# Altium schematic sheet ADCBoard.SchDoc
size OrCAD A
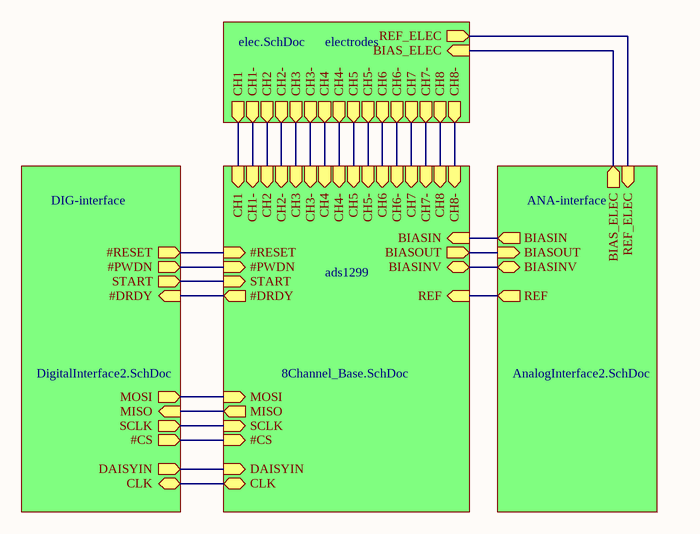
[diagram p0: ADCBoard.SchDoc]

## Sub-sheets
ads1299 = 8Channel_Base.SchDoc: CH1- (in), CH2 (in), CH2- (in), CH3 (in), CH3- (in), CH4 (in), CH4- (in), CH5 (in), CH5- (in), CH6 (in), CH6- (in), CH7 (in), CH7- (in), CH8 (in), CH8- (in), CH1 (in), BIASIN (in), BIASOUT (out), BIASINV (bidir), REF (in), #RESET (in), #PWDN (in), START (in), #DRDY (out), MOSI (in), MISO (out), SCLK (in), #CS (in), DAISYIN (in), CLK (bidir)
ANA-interface = AnalogInterface2.SchDoc: BIAS_ELEC (out), REF_ELEC (in), BIASIN (out), BIASOUT (in), BIASINV (bidir), REF (out)
DIG-interface = DigitalInterface2.SchDoc: #RESET (out), #PWDN (out), START (out), #DRDY (in), MOSI (out), MISO (in), SCLK (out), #CS (out), DAISYIN (out), CLK (bidir)
electrodes = elec.SchDoc: CH1- (out), CH2 (out), CH2- (out), CH3 (out), CH3- (out), CH4 (out), CH4- (out), CH5 (out), CH5- (out), CH6 (out), CH6- (out), CH7 (out), CH7- (out), CH8 (out), CH8- (out), CH1 (out), BIAS_ELEC (in), REF_ELEC (out)

## Nets
(unnamed): sheet ads1299/CH1-, sheet electrodes/CH1-
(unnamed): sheet ads1299/CH2, sheet electrodes/CH2
(unnamed): sheet ads1299/CH2-, sheet electrodes/CH2-
(unnamed): sheet ads1299/CH3, sheet electrodes/CH3
(unnamed): sheet ads1299/CH3-, sheet electrodes/CH3-
(unnamed): sheet ads1299/CH4, sheet electrodes/CH4
(unnamed): sheet ads1299/CH4-, sheet electrodes/CH4-
(unnamed): sheet ads1299/CH5, sheet electrodes/CH5
(unnamed): sheet ads1299/CH5-, sheet electrodes/CH5-
(unnamed): sheet ads1299/CH6, sheet electrodes/CH6
(unnamed): sheet ads1299/CH6-, sheet electrodes/CH6-
(unnamed): sheet ads1299/CH7, sheet electrodes/CH7
(unnamed): sheet ads1299/CH7-, sheet electrodes/CH7-
(unnamed): sheet ads1299/CH8, sheet electrodes/CH8
(unnamed): sheet ads1299/CH8-, sheet electrodes/CH8-
(unnamed): sheet ads1299/CH1, sheet electrodes/CH1
(unnamed): sheet ads1299/BIASIN, sheet ANA-interface/BIASIN
(unnamed): sheet ads1299/BIASOUT, sheet ANA-interface/BIASOUT
(unnamed): sheet ads1299/BIASINV, sheet ANA-interface/BIASINV
(unnamed): sheet ads1299/REF, sheet ANA-interface/REF
(unnamed): sheet ads1299/#RESET, sheet DIG-interface/#RESET
(unnamed): sheet ads1299/#PWDN, sheet DIG-interface/#PWDN
(unnamed): sheet ads1299/START, sheet DIG-interface/START
(unnamed): sheet ads1299/#DRDY, sheet DIG-interface/#DRDY
(unnamed): sheet ads1299/MOSI, sheet DIG-interface/MOSI
(unnamed): sheet ads1299/MISO, sheet DIG-interface/MISO
(unnamed): sheet ads1299/SCLK, sheet DIG-interface/SCLK
(unnamed): sheet ads1299/#CS, sheet DIG-interface/#CS
(unnamed): sheet ads1299/DAISYIN, sheet DIG-interface/DAISYIN
(unnamed): sheet ads1299/CLK, sheet DIG-interface/CLK
(unnamed): sheet ANA-interface/BIAS_ELEC, sheet electrodes/BIAS_ELEC
(unnamed): sheet ANA-interface/REF_ELEC, sheet electrodes/REF_ELEC

## Notes on the sheet
- Title
- Size:
- Date:
- Orcad A
- Number:
- Time:
- Revision:
- Sheet
- of
- File: